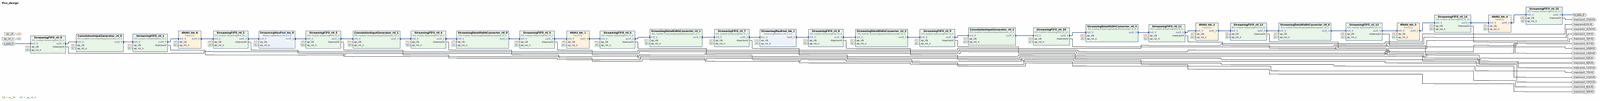
[diagram p0: block diagram of the top level, whole]
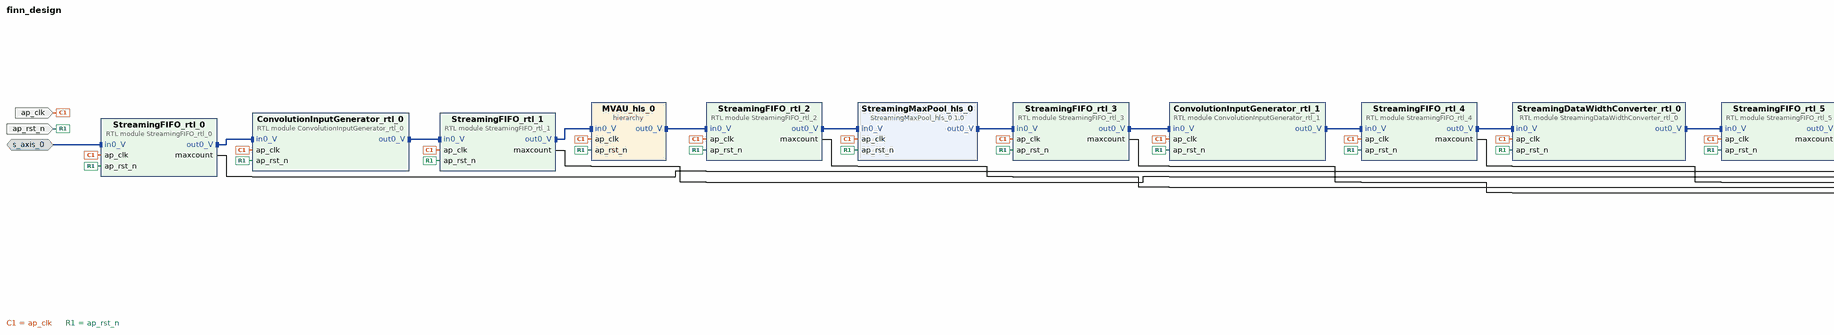
[diagram p1: block diagram of the top level, left part]
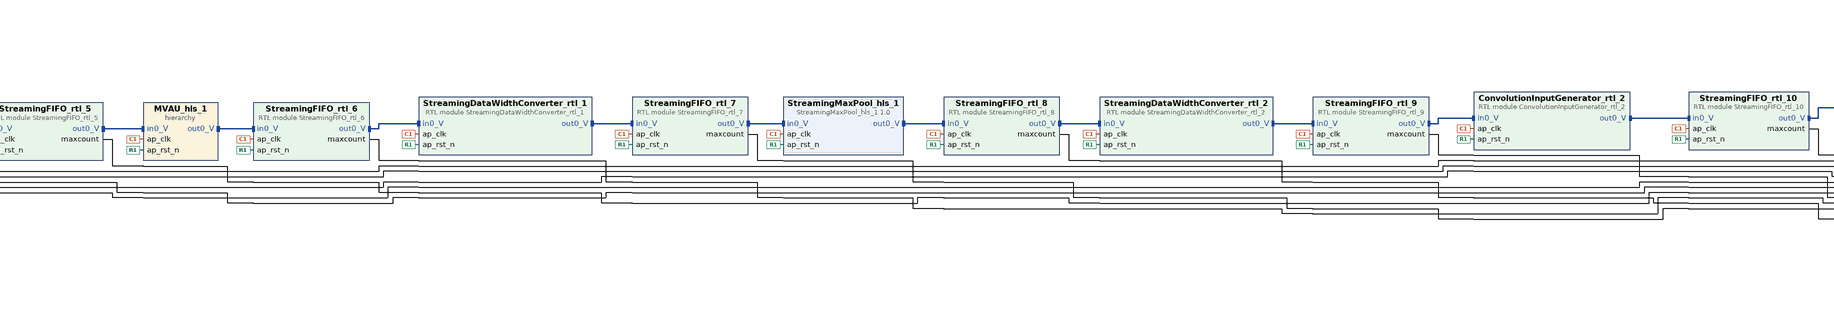
[diagram p2: block diagram of the top level, centre part]
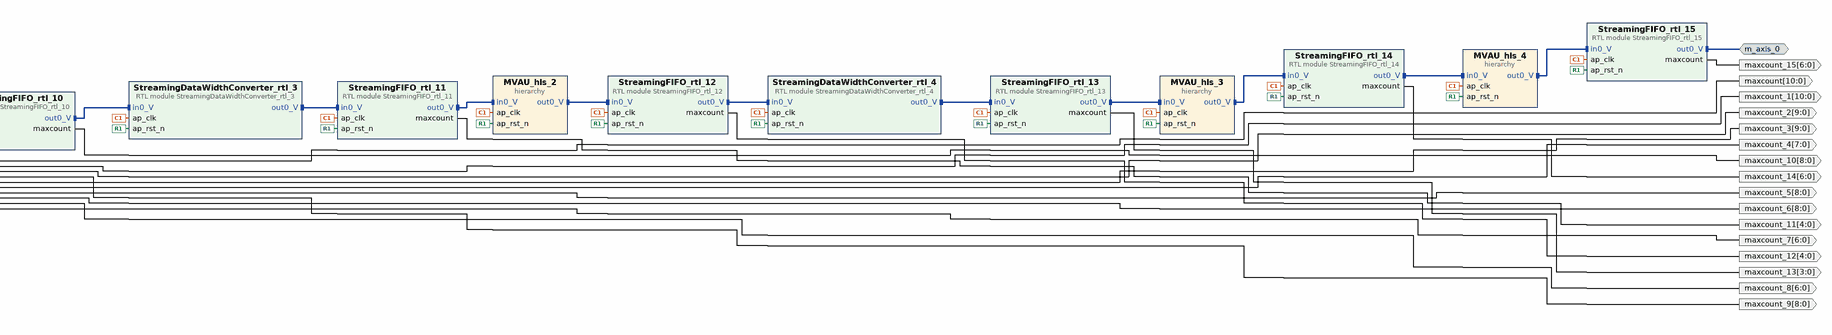
[diagram p3: block diagram of the top level, right part]
# Vivado block design finn_design, xczu7ev-ffvc1156-2-e, Vivado 2022.2
create_bd_design finn_design

create_bd_intf_port -mode Slave -vlnv xilinx.com:interface:axis_rtl:1.0 s_axis_0
set_property -dict [list \
  CONFIG.HAS_TKEEP 0 \
  CONFIG.HAS_TLAST 0 \
  CONFIG.HAS_TREADY 1 \
  CONFIG.HAS_TSTRB 0 \
  CONFIG.LAYERED_METADATA undef \
  CONFIG.TDATA_NUM_BYTES 1 \
  CONFIG.TDEST_WIDTH 0 \
  CONFIG.TID_WIDTH 0 \
  CONFIG.TUSER_WIDTH 0 \
] [get_bd_intf_ports s_axis_0]
create_bd_intf_port -mode Master -vlnv xilinx.com:interface:axis_rtl:1.0 m_axis_0
create_bd_port -dir I -type clk ap_clk
set_property -dict {CONFIG.FREQ_HZ 100000000} [get_bd_ports ap_clk]
create_bd_port -dir I -type rst ap_rst_n
create_bd_port -dir O -from 10 -to 0 maxcount
create_bd_port -dir O -from 10 -to 0 maxcount_1
create_bd_port -dir O -from 9 -to 0 maxcount_2
create_bd_port -dir O -from 9 -to 0 maxcount_3
create_bd_port -dir O -from 7 -to 0 maxcount_4
create_bd_port -dir O -from 8 -to 0 maxcount_5
create_bd_port -dir O -from 8 -to 0 maxcount_6
create_bd_port -dir O -from 6 -to 0 maxcount_7
create_bd_port -dir O -from 6 -to 0 maxcount_8
create_bd_port -dir O -from 8 -to 0 maxcount_9
create_bd_port -dir O -from 8 -to 0 maxcount_10
create_bd_port -dir O -from 4 -to 0 maxcount_11
create_bd_port -dir O -from 4 -to 0 maxcount_12
create_bd_port -dir O -from 3 -to 0 maxcount_13
create_bd_port -dir O -from 6 -to 0 maxcount_14
create_bd_port -dir O -from 6 -to 0 maxcount_15

create_bd_cell -type module -reference StreamingFIFO_rtl_0 StreamingFIFO_rtl_0
create_bd_cell -type module -reference ConvolutionInputGenerator_rtl_0 ConvolutionInputGenerator_rtl_0
create_bd_cell -type module -reference StreamingFIFO_rtl_1 StreamingFIFO_rtl_1
create_bd_cell -type hier MVAU_hls_0
create_bd_cell -type module -reference StreamingFIFO_rtl_2 StreamingFIFO_rtl_2
create_bd_cell -type ip -vlnv xilinx.com:hls:StreamingMaxPool_hls_0:1.0 StreamingMaxPool_hls_0
create_bd_cell -type module -reference StreamingFIFO_rtl_3 StreamingFIFO_rtl_3
create_bd_cell -type module -reference ConvolutionInputGenerator_rtl_1 ConvolutionInputGenerator_rtl_1
create_bd_cell -type module -reference StreamingFIFO_rtl_4 StreamingFIFO_rtl_4
create_bd_cell -type module -reference StreamingDataWidthConverter_rtl_0 StreamingDataWidthConverter_rtl_0
create_bd_cell -type module -reference StreamingFIFO_rtl_5 StreamingFIFO_rtl_5
create_bd_cell -type hier MVAU_hls_1
create_bd_cell -type module -reference StreamingFIFO_rtl_6 StreamingFIFO_rtl_6
create_bd_cell -type module -reference StreamingDataWidthConverter_rtl_1 StreamingDataWidthConverter_rtl_1
create_bd_cell -type module -reference StreamingFIFO_rtl_7 StreamingFIFO_rtl_7
create_bd_cell -type ip -vlnv xilinx.com:hls:StreamingMaxPool_hls_1:1.0 StreamingMaxPool_hls_1
create_bd_cell -type module -reference StreamingFIFO_rtl_8 StreamingFIFO_rtl_8
create_bd_cell -type module -reference StreamingDataWidthConverter_rtl_2 StreamingDataWidthConverter_rtl_2
create_bd_cell -type module -reference StreamingFIFO_rtl_9 StreamingFIFO_rtl_9
create_bd_cell -type module -reference ConvolutionInputGenerator_rtl_2 ConvolutionInputGenerator_rtl_2
create_bd_cell -type module -reference StreamingFIFO_rtl_10 StreamingFIFO_rtl_10
create_bd_cell -type module -reference StreamingDataWidthConverter_rtl_3 StreamingDataWidthConverter_rtl_3
create_bd_cell -type module -reference StreamingFIFO_rtl_11 StreamingFIFO_rtl_11
create_bd_cell -type hier MVAU_hls_2
create_bd_cell -type module -reference StreamingFIFO_rtl_12 StreamingFIFO_rtl_12
create_bd_cell -type module -reference StreamingDataWidthConverter_rtl_4 StreamingDataWidthConverter_rtl_4
create_bd_cell -type module -reference StreamingFIFO_rtl_13 StreamingFIFO_rtl_13
create_bd_cell -type hier MVAU_hls_3
create_bd_cell -type module -reference StreamingFIFO_rtl_14 StreamingFIFO_rtl_14
create_bd_cell -type hier MVAU_hls_4
create_bd_cell -type module -reference StreamingFIFO_rtl_15 StreamingFIFO_rtl_15

# ---- hierarchy /MVAU_hls_0 ----
current_bd_instance /MVAU_hls_0
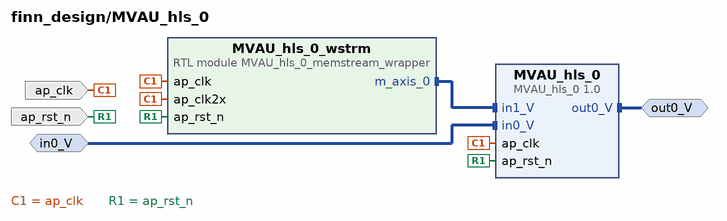
[diagram p4: block diagram inside /MVAU_hls_0]
create_bd_intf_pin -mode Master -vlnv xilinx.com:interface:axis_rtl:1.0 out0_V
create_bd_intf_pin -mode Slave -vlnv xilinx.com:interface:axis_rtl:1.0 in0_V
create_bd_pin -dir I -type clk ap_clk
create_bd_pin -dir I -type rst ap_rst_n

create_bd_cell -type ip -vlnv xilinx.com:hls:MVAU_hls_0:1.0 MVAU_hls_0
create_bd_cell -type module -reference MVAU_hls_0_memstream_wrapper MVAU_hls_0_wstrm

# ---- hierarchy /MVAU_hls_1 ----
current_bd_instance /MVAU_hls_1
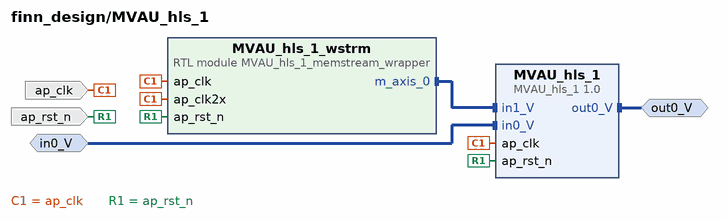
[diagram p5: block diagram inside /MVAU_hls_1]
create_bd_intf_pin -mode Master -vlnv xilinx.com:interface:axis_rtl:1.0 out0_V
create_bd_intf_pin -mode Slave -vlnv xilinx.com:interface:axis_rtl:1.0 in0_V
create_bd_pin -dir I -type clk ap_clk
create_bd_pin -dir I -type rst ap_rst_n

create_bd_cell -type ip -vlnv xilinx.com:hls:MVAU_hls_1:1.0 MVAU_hls_1
create_bd_cell -type module -reference MVAU_hls_1_memstream_wrapper MVAU_hls_1_wstrm

# ---- hierarchy /MVAU_hls_2 ----
current_bd_instance /MVAU_hls_2
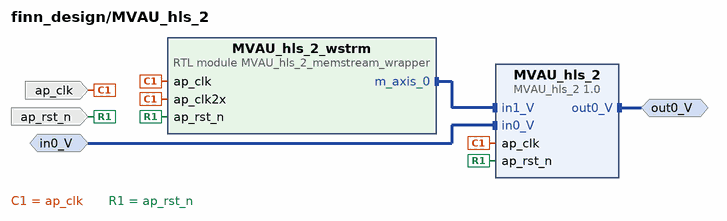
[diagram p6: block diagram inside /MVAU_hls_2]
create_bd_intf_pin -mode Master -vlnv xilinx.com:interface:axis_rtl:1.0 out0_V
create_bd_intf_pin -mode Slave -vlnv xilinx.com:interface:axis_rtl:1.0 in0_V
create_bd_pin -dir I -type clk ap_clk
create_bd_pin -dir I -type rst ap_rst_n

create_bd_cell -type ip -vlnv xilinx.com:hls:MVAU_hls_2:1.0 MVAU_hls_2
create_bd_cell -type module -reference MVAU_hls_2_memstream_wrapper MVAU_hls_2_wstrm

# ---- hierarchy /MVAU_hls_3 ----
current_bd_instance /MVAU_hls_3
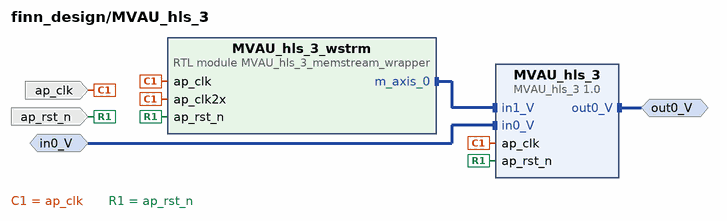
[diagram p7: block diagram inside /MVAU_hls_3]
create_bd_intf_pin -mode Master -vlnv xilinx.com:interface:axis_rtl:1.0 out0_V
create_bd_intf_pin -mode Slave -vlnv xilinx.com:interface:axis_rtl:1.0 in0_V
create_bd_pin -dir I -type clk ap_clk
create_bd_pin -dir I -type rst ap_rst_n

create_bd_cell -type ip -vlnv xilinx.com:hls:MVAU_hls_3:1.0 MVAU_hls_3
create_bd_cell -type module -reference MVAU_hls_3_memstream_wrapper MVAU_hls_3_wstrm

# ---- hierarchy /MVAU_hls_4 ----
current_bd_instance /MVAU_hls_4
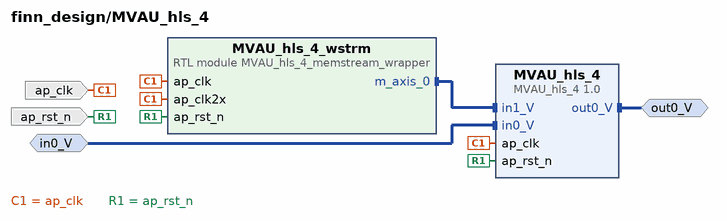
[diagram p8: block diagram inside /MVAU_hls_4]
create_bd_intf_pin -mode Master -vlnv xilinx.com:interface:axis_rtl:1.0 out0_V
create_bd_intf_pin -mode Slave -vlnv xilinx.com:interface:axis_rtl:1.0 in0_V
create_bd_pin -dir I -type clk ap_clk
create_bd_pin -dir I -type rst ap_rst_n

create_bd_cell -type ip -vlnv xilinx.com:hls:MVAU_hls_4:1.0 MVAU_hls_4
create_bd_cell -type module -reference MVAU_hls_4_memstream_wrapper MVAU_hls_4_wstrm

# ---- connections ----

current_bd_instance /MVAU_hls_0
connect_bd_intf_net [get_bd_intf_pins out0_V] [get_bd_intf_pins MVAU_hls_0/out0_V]
connect_bd_intf_net [get_bd_intf_pins MVAU_hls_0_wstrm/m_axis_0] [get_bd_intf_pins MVAU_hls_0/in1_V]
connect_bd_intf_net [get_bd_intf_pins in0_V] [get_bd_intf_pins MVAU_hls_0/in0_V]
connect_bd_net [get_bd_pins ap_clk] [get_bd_pins MVAU_hls_0_wstrm/ap_clk] [get_bd_pins MVAU_hls_0_wstrm/ap_clk2x] [get_bd_pins MVAU_hls_0/ap_clk]
connect_bd_net [get_bd_pins ap_rst_n] [get_bd_pins MVAU_hls_0_wstrm/ap_rst_n] [get_bd_pins MVAU_hls_0/ap_rst_n]

current_bd_instance /MVAU_hls_1
connect_bd_intf_net [get_bd_intf_pins out0_V] [get_bd_intf_pins MVAU_hls_1/out0_V]
connect_bd_intf_net [get_bd_intf_pins MVAU_hls_1_wstrm/m_axis_0] [get_bd_intf_pins MVAU_hls_1/in1_V]
connect_bd_intf_net [get_bd_intf_pins in0_V] [get_bd_intf_pins MVAU_hls_1/in0_V]
connect_bd_net [get_bd_pins ap_clk] [get_bd_pins MVAU_hls_1_wstrm/ap_clk] [get_bd_pins MVAU_hls_1_wstrm/ap_clk2x] [get_bd_pins MVAU_hls_1/ap_clk]
connect_bd_net [get_bd_pins ap_rst_n] [get_bd_pins MVAU_hls_1_wstrm/ap_rst_n] [get_bd_pins MVAU_hls_1/ap_rst_n]

current_bd_instance /MVAU_hls_2
connect_bd_intf_net [get_bd_intf_pins out0_V] [get_bd_intf_pins MVAU_hls_2/out0_V]
connect_bd_intf_net [get_bd_intf_pins MVAU_hls_2_wstrm/m_axis_0] [get_bd_intf_pins MVAU_hls_2/in1_V]
connect_bd_intf_net [get_bd_intf_pins in0_V] [get_bd_intf_pins MVAU_hls_2/in0_V]
connect_bd_net [get_bd_pins ap_clk] [get_bd_pins MVAU_hls_2_wstrm/ap_clk] [get_bd_pins MVAU_hls_2_wstrm/ap_clk2x] [get_bd_pins MVAU_hls_2/ap_clk]
connect_bd_net [get_bd_pins ap_rst_n] [get_bd_pins MVAU_hls_2_wstrm/ap_rst_n] [get_bd_pins MVAU_hls_2/ap_rst_n]

current_bd_instance /MVAU_hls_3
connect_bd_intf_net [get_bd_intf_pins out0_V] [get_bd_intf_pins MVAU_hls_3/out0_V]
connect_bd_intf_net [get_bd_intf_pins MVAU_hls_3_wstrm/m_axis_0] [get_bd_intf_pins MVAU_hls_3/in1_V]
connect_bd_intf_net [get_bd_intf_pins in0_V] [get_bd_intf_pins MVAU_hls_3/in0_V]
connect_bd_net [get_bd_pins ap_clk] [get_bd_pins MVAU_hls_3_wstrm/ap_clk] [get_bd_pins MVAU_hls_3_wstrm/ap_clk2x] [get_bd_pins MVAU_hls_3/ap_clk]
connect_bd_net [get_bd_pins ap_rst_n] [get_bd_pins MVAU_hls_3_wstrm/ap_rst_n] [get_bd_pins MVAU_hls_3/ap_rst_n]

current_bd_instance /MVAU_hls_4
connect_bd_intf_net [get_bd_intf_pins out0_V] [get_bd_intf_pins MVAU_hls_4/out0_V]
connect_bd_intf_net [get_bd_intf_pins MVAU_hls_4_wstrm/m_axis_0] [get_bd_intf_pins MVAU_hls_4/in1_V]
connect_bd_intf_net [get_bd_intf_pins in0_V] [get_bd_intf_pins MVAU_hls_4/in0_V]
connect_bd_net [get_bd_pins ap_clk] [get_bd_pins MVAU_hls_4_wstrm/ap_clk] [get_bd_pins MVAU_hls_4_wstrm/ap_clk2x] [get_bd_pins MVAU_hls_4/ap_clk]
connect_bd_net [get_bd_pins ap_rst_n] [get_bd_pins MVAU_hls_4_wstrm/ap_rst_n] [get_bd_pins MVAU_hls_4/ap_rst_n]

current_bd_instance /
connect_bd_intf_net [get_bd_intf_pins ConvolutionInputGenerator_rtl_0/out0_V] [get_bd_intf_pins StreamingFIFO_rtl_1/in0_V]
connect_bd_intf_net [get_bd_intf_pins ConvolutionInputGenerator_rtl_1/out0_V] [get_bd_intf_pins StreamingFIFO_rtl_4/in0_V]
connect_bd_intf_net [get_bd_intf_pins ConvolutionInputGenerator_rtl_2/out0_V] [get_bd_intf_pins StreamingFIFO_rtl_10/in0_V]
connect_bd_intf_net [get_bd_intf_pins MVAU_hls_0/out0_V] [get_bd_intf_pins StreamingFIFO_rtl_2/in0_V]
connect_bd_intf_net [get_bd_intf_pins MVAU_hls_1/out0_V] [get_bd_intf_pins StreamingFIFO_rtl_6/in0_V]
connect_bd_intf_net [get_bd_intf_pins MVAU_hls_2/out0_V] [get_bd_intf_pins StreamingFIFO_rtl_12/in0_V]
connect_bd_intf_net [get_bd_intf_pins MVAU_hls_3/out0_V] [get_bd_intf_pins StreamingFIFO_rtl_14/in0_V]
connect_bd_intf_net [get_bd_intf_pins MVAU_hls_4/out0_V] [get_bd_intf_pins StreamingFIFO_rtl_15/in0_V]
connect_bd_intf_net [get_bd_intf_pins StreamingDataWidthConverter_rtl_0/out0_V] [get_bd_intf_pins StreamingFIFO_rtl_5/in0_V]
connect_bd_intf_net [get_bd_intf_pins StreamingDataWidthConverter_rtl_1/out0_V] [get_bd_intf_pins StreamingFIFO_rtl_7/in0_V]
connect_bd_intf_net [get_bd_intf_pins StreamingDataWidthConverter_rtl_2/out0_V] [get_bd_intf_pins StreamingFIFO_rtl_9/in0_V]
connect_bd_intf_net [get_bd_intf_pins StreamingDataWidthConverter_rtl_3/out0_V] [get_bd_intf_pins StreamingFIFO_rtl_11/in0_V]
connect_bd_intf_net [get_bd_intf_pins StreamingDataWidthConverter_rtl_4/out0_V] [get_bd_intf_pins StreamingFIFO_rtl_13/in0_V]
connect_bd_intf_net [get_bd_intf_pins StreamingFIFO_rtl_0/out0_V] [get_bd_intf_pins ConvolutionInputGenerator_rtl_0/in0_V]
connect_bd_intf_net [get_bd_intf_pins StreamingFIFO_rtl_10/out0_V] [get_bd_intf_pins StreamingDataWidthConverter_rtl_3/in0_V]
connect_bd_intf_net [get_bd_intf_pins StreamingFIFO_rtl_11/out0_V] [get_bd_intf_pins MVAU_hls_2/in0_V]
connect_bd_intf_net [get_bd_intf_pins StreamingFIFO_rtl_12/out0_V] [get_bd_intf_pins StreamingDataWidthConverter_rtl_4/in0_V]
connect_bd_intf_net [get_bd_intf_pins StreamingFIFO_rtl_13/out0_V] [get_bd_intf_pins MVAU_hls_3/in0_V]
connect_bd_intf_net [get_bd_intf_pins StreamingFIFO_rtl_14/out0_V] [get_bd_intf_pins MVAU_hls_4/in0_V]
connect_bd_intf_net [get_bd_intf_ports m_axis_0] [get_bd_intf_pins StreamingFIFO_rtl_15/out0_V]
connect_bd_intf_net [get_bd_intf_pins StreamingFIFO_rtl_1/out0_V] [get_bd_intf_pins MVAU_hls_0/in0_V]
connect_bd_intf_net [get_bd_intf_pins StreamingFIFO_rtl_2/out0_V] [get_bd_intf_pins StreamingMaxPool_hls_0/in0_V]
connect_bd_intf_net [get_bd_intf_pins StreamingFIFO_rtl_3/out0_V] [get_bd_intf_pins ConvolutionInputGenerator_rtl_1/in0_V]
connect_bd_intf_net [get_bd_intf_pins StreamingFIFO_rtl_4/out0_V] [get_bd_intf_pins StreamingDataWidthConverter_rtl_0/in0_V]
connect_bd_intf_net [get_bd_intf_pins StreamingFIFO_rtl_5/out0_V] [get_bd_intf_pins MVAU_hls_1/in0_V]
connect_bd_intf_net [get_bd_intf_pins StreamingFIFO_rtl_6/out0_V] [get_bd_intf_pins StreamingDataWidthConverter_rtl_1/in0_V]
connect_bd_intf_net [get_bd_intf_pins StreamingFIFO_rtl_7/out0_V] [get_bd_intf_pins StreamingMaxPool_hls_1/in0_V]
connect_bd_intf_net [get_bd_intf_pins StreamingFIFO_rtl_8/out0_V] [get_bd_intf_pins StreamingDataWidthConverter_rtl_2/in0_V]
connect_bd_intf_net [get_bd_intf_pins StreamingFIFO_rtl_9/out0_V] [get_bd_intf_pins ConvolutionInputGenerator_rtl_2/in0_V]
connect_bd_intf_net [get_bd_intf_pins StreamingMaxPool_hls_0/out0_V] [get_bd_intf_pins StreamingFIFO_rtl_3/in0_V]
connect_bd_intf_net [get_bd_intf_pins StreamingMaxPool_hls_1/out0_V] [get_bd_intf_pins StreamingFIFO_rtl_8/in0_V]
connect_bd_intf_net -intf_net in0_V_0_1 [get_bd_intf_ports s_axis_0] [get_bd_intf_pins StreamingFIFO_rtl_0/in0_V]
connect_bd_net [get_bd_pins StreamingFIFO_rtl_0/maxcount] [get_bd_ports maxcount]
connect_bd_net [get_bd_pins StreamingFIFO_rtl_10/maxcount] [get_bd_ports maxcount_10]
connect_bd_net [get_bd_pins StreamingFIFO_rtl_11/maxcount] [get_bd_ports maxcount_11]
connect_bd_net [get_bd_pins StreamingFIFO_rtl_12/maxcount] [get_bd_ports maxcount_12]
connect_bd_net [get_bd_pins StreamingFIFO_rtl_13/maxcount] [get_bd_ports maxcount_13]
connect_bd_net [get_bd_pins StreamingFIFO_rtl_14/maxcount] [get_bd_ports maxcount_14]
connect_bd_net [get_bd_pins StreamingFIFO_rtl_15/maxcount] [get_bd_ports maxcount_15]
connect_bd_net [get_bd_pins StreamingFIFO_rtl_1/maxcount] [get_bd_ports maxcount_1]
connect_bd_net [get_bd_pins StreamingFIFO_rtl_2/maxcount] [get_bd_ports maxcount_2]
connect_bd_net [get_bd_pins StreamingFIFO_rtl_3/maxcount] [get_bd_ports maxcount_3]
connect_bd_net [get_bd_pins StreamingFIFO_rtl_4/maxcount] [get_bd_ports maxcount_4]
connect_bd_net [get_bd_pins StreamingFIFO_rtl_5/maxcount] [get_bd_ports maxcount_5]
connect_bd_net [get_bd_pins StreamingFIFO_rtl_6/maxcount] [get_bd_ports maxcount_6]
connect_bd_net [get_bd_pins StreamingFIFO_rtl_7/maxcount] [get_bd_ports maxcount_7]
connect_bd_net [get_bd_pins StreamingFIFO_rtl_8/maxcount] [get_bd_ports maxcount_8]
connect_bd_net [get_bd_pins StreamingFIFO_rtl_9/maxcount] [get_bd_ports maxcount_9]
connect_bd_net -net ap_clk_0_1 [get_bd_ports ap_clk] \
  [get_bd_pins StreamingFIFO_rtl_0/ap_clk] [get_bd_pins ConvolutionInputGenerator_rtl_0/ap_clk] \
  [get_bd_pins StreamingFIFO_rtl_1/ap_clk] [get_bd_pins MVAU_hls_0/ap_clk] [get_bd_pins StreamingFIFO_rtl_2/ap_clk] \
  [get_bd_pins StreamingMaxPool_hls_0/ap_clk] [get_bd_pins StreamingFIFO_rtl_3/ap_clk] \
  [get_bd_pins ConvolutionInputGenerator_rtl_1/ap_clk] [get_bd_pins StreamingFIFO_rtl_4/ap_clk] \
  [get_bd_pins StreamingDataWidthConverter_rtl_0/ap_clk] [get_bd_pins StreamingFIFO_rtl_5/ap_clk] \
  [get_bd_pins MVAU_hls_1/ap_clk] [get_bd_pins StreamingFIFO_rtl_6/ap_clk] \
  [get_bd_pins StreamingDataWidthConverter_rtl_1/ap_clk] [get_bd_pins StreamingFIFO_rtl_7/ap_clk] \
  [get_bd_pins StreamingMaxPool_hls_1/ap_clk] [get_bd_pins StreamingFIFO_rtl_8/ap_clk] \
  [get_bd_pins StreamingDataWidthConverter_rtl_2/ap_clk] [get_bd_pins StreamingFIFO_rtl_9/ap_clk] \
  [get_bd_pins ConvolutionInputGenerator_rtl_2/ap_clk] [get_bd_pins StreamingFIFO_rtl_10/ap_clk] \
  [get_bd_pins StreamingDataWidthConverter_rtl_3/ap_clk] [get_bd_pins StreamingFIFO_rtl_11/ap_clk] \
  [get_bd_pins MVAU_hls_2/ap_clk] [get_bd_pins StreamingFIFO_rtl_12/ap_clk] \
  [get_bd_pins StreamingDataWidthConverter_rtl_4/ap_clk] [get_bd_pins StreamingFIFO_rtl_13/ap_clk] \
  [get_bd_pins MVAU_hls_3/ap_clk] [get_bd_pins StreamingFIFO_rtl_14/ap_clk] [get_bd_pins MVAU_hls_4/ap_clk] \
  [get_bd_pins StreamingFIFO_rtl_15/ap_clk]
connect_bd_net -net ap_rst_n_0_1 [get_bd_ports ap_rst_n] \
  [get_bd_pins StreamingFIFO_rtl_0/ap_rst_n] [get_bd_pins ConvolutionInputGenerator_rtl_0/ap_rst_n] \
  [get_bd_pins StreamingFIFO_rtl_1/ap_rst_n] [get_bd_pins MVAU_hls_0/ap_rst_n] [get_bd_pins StreamingFIFO_rtl_2/ap_rst_n] \
  [get_bd_pins StreamingMaxPool_hls_0/ap_rst_n] [get_bd_pins StreamingFIFO_rtl_3/ap_rst_n] \
  [get_bd_pins ConvolutionInputGenerator_rtl_1/ap_rst_n] [get_bd_pins StreamingFIFO_rtl_4/ap_rst_n] \
  [get_bd_pins StreamingDataWidthConverter_rtl_0/ap_rst_n] [get_bd_pins StreamingFIFO_rtl_5/ap_rst_n] \
  [get_bd_pins MVAU_hls_1/ap_rst_n] [get_bd_pins StreamingFIFO_rtl_6/ap_rst_n] \
  [get_bd_pins StreamingDataWidthConverter_rtl_1/ap_rst_n] [get_bd_pins StreamingFIFO_rtl_7/ap_rst_n] \
  [get_bd_pins StreamingMaxPool_hls_1/ap_rst_n] [get_bd_pins StreamingFIFO_rtl_8/ap_rst_n] \
  [get_bd_pins StreamingDataWidthConverter_rtl_2/ap_rst_n] [get_bd_pins StreamingFIFO_rtl_9/ap_rst_n] \
  [get_bd_pins ConvolutionInputGenerator_rtl_2/ap_rst_n] [get_bd_pins StreamingFIFO_rtl_10/ap_rst_n] \
  [get_bd_pins StreamingDataWidthConverter_rtl_3/ap_rst_n] [get_bd_pins StreamingFIFO_rtl_11/ap_rst_n] \
  [get_bd_pins MVAU_hls_2/ap_rst_n] [get_bd_pins StreamingFIFO_rtl_12/ap_rst_n] \
  [get_bd_pins StreamingDataWidthConverter_rtl_4/ap_rst_n] [get_bd_pins StreamingFIFO_rtl_13/ap_rst_n] \
  [get_bd_pins MVAU_hls_3/ap_rst_n] [get_bd_pins StreamingFIFO_rtl_14/ap_rst_n] [get_bd_pins MVAU_hls_4/ap_rst_n] \
  [get_bd_pins StreamingFIFO_rtl_15/ap_rst_n]

validate_bd_design
save_bd_design
